# EAGLE design Schematic (EAGLE 7.3.0)
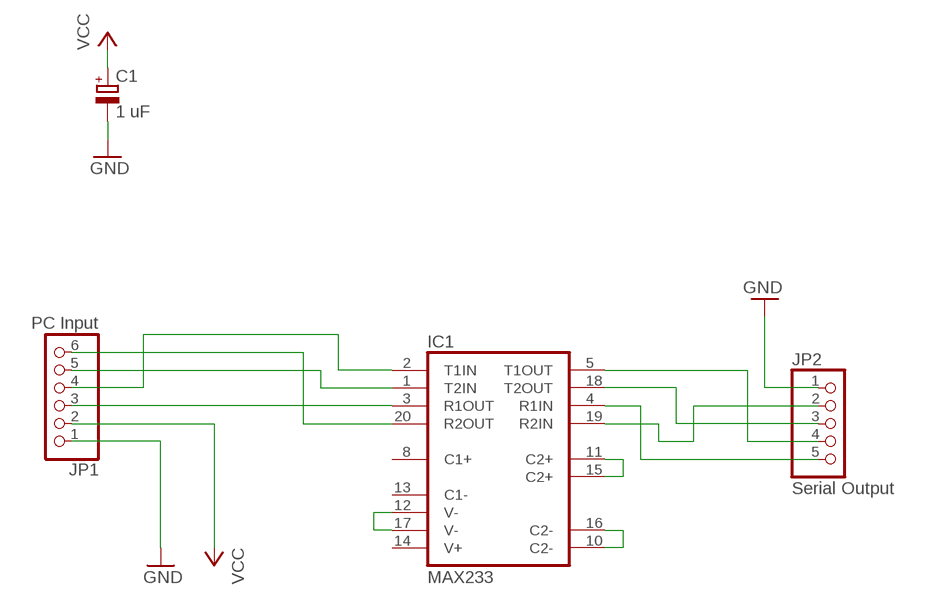
[diagram p0: schematic, sheet 1]

## Parts
C1  1 uF  CPOL-EUE2.5-6  [E2,5-6]
IC1  MAX233  [DIL20]
JP1  PC Input  PINHD-1X6  [1X06]
JP2  Serial Output  PINHD-1X5  [1X05]

## Nets
GND: C1.- JP1.1 JP2.1
N$1: IC1.12(V-) IC1.17(V-)
N$2: IC1.11(C2+) IC1.15(C2+)
N$3: IC1.10(C2-) IC1.16(C2-)
N$4: IC1.20(R2OUT) JP1.6
N$5: IC1.1(T2IN) JP1.5
N$6: IC1.2(T1IN) JP1.4
N$7: IC1.3(R1OUT) JP1.3
N$8: IC1.18(T2OUT) JP2.3
N$9: IC1.19(R2IN) JP2.2
N$10: IC1.5(T1OUT) JP2.4
N$11: IC1.4(R1IN) JP2.5
VCC: C1.+ JP1.2
Unconnected: IC1.8(C1+) IC1.13(C1-) IC1.14(V+)

## Power pins joined to a net without a drawn wire
GND: IC1.6(GND) IC1.9(GND)
VCC: IC1.7(VCC)

## Library data of the parts
C1 = resistor:CPOL-EU: POLARIZED CAPACITOR, European symbol
IC1 = maxim:MAX233: RS232 TRANSCEIVER; MPN: MAX233ACPP+G36; OC_FARNELL: 1593332; OC_NEWARK: 89K3459
JP1 = pinhead:PINHD-1X6: PIN HEADER
JP2 = pinhead:PINHD-1X5: PIN HEADER

## Board
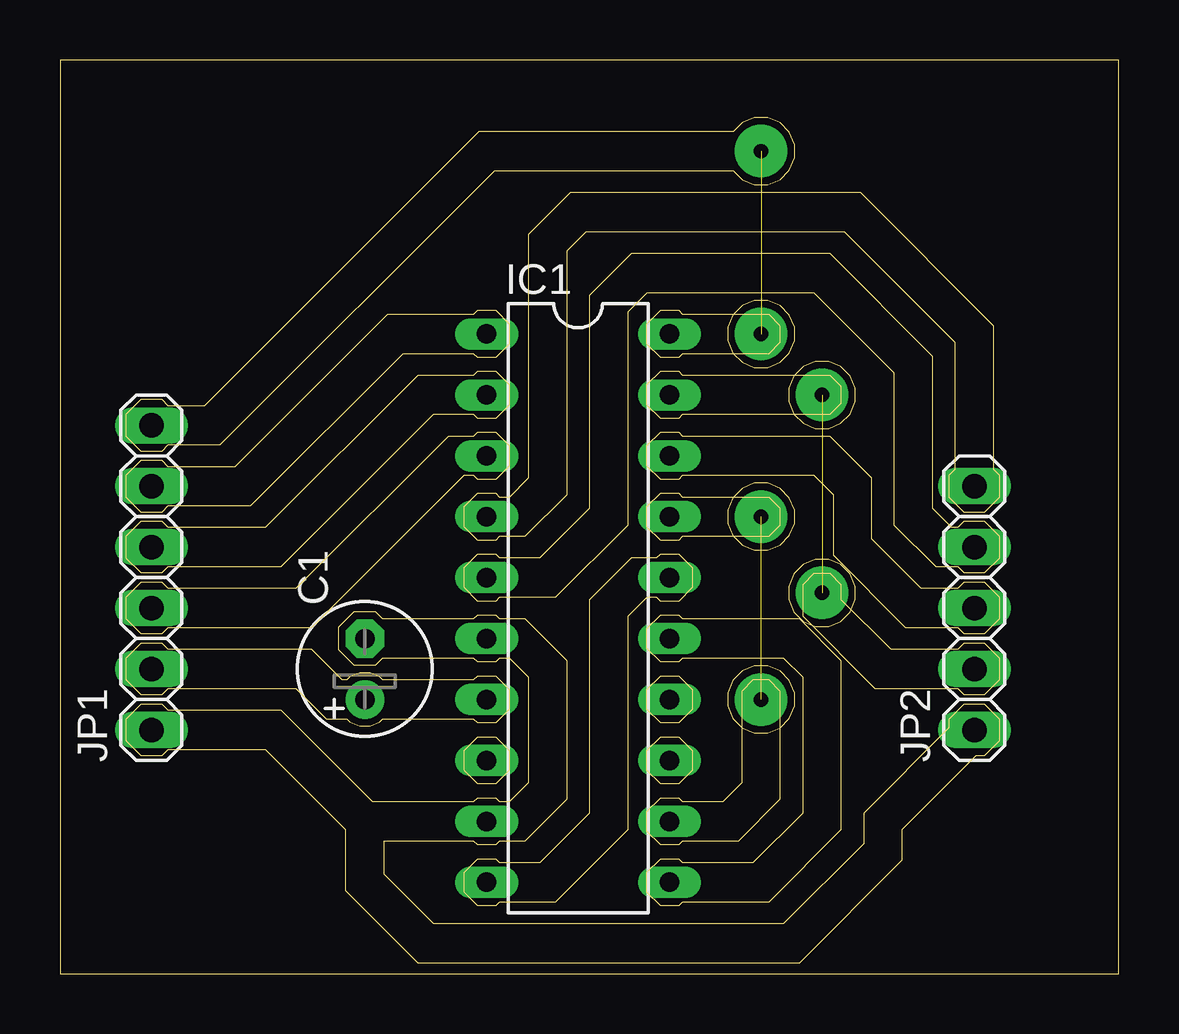
[diagram p1: board, top side]
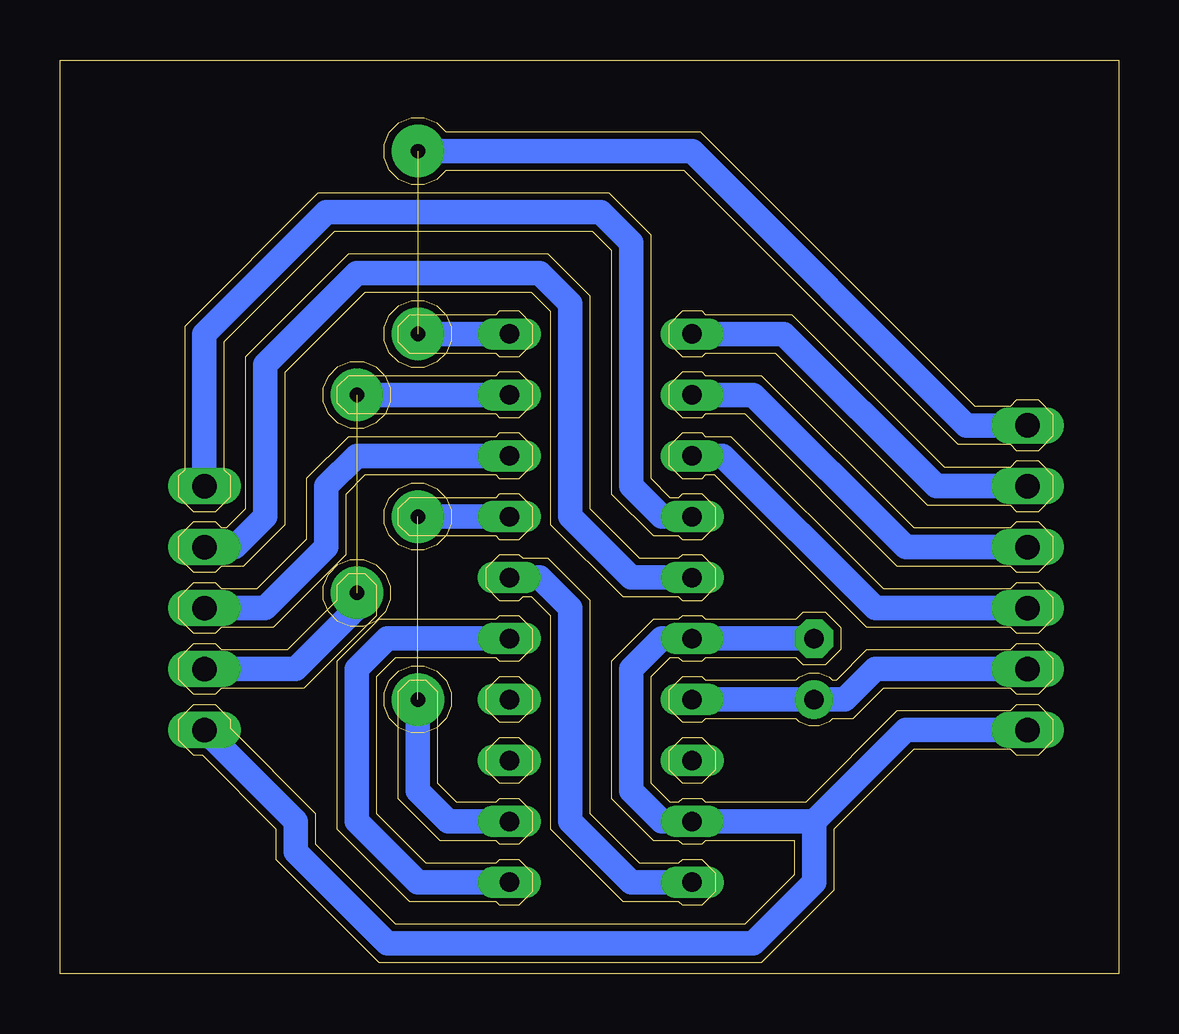
[diagram p2: board, bottom side, seen from below]

Size 44.12 x 38.09 mm. Coordinates in mm from the lower left corner, seen from the top.
Outline: 0,0 44.12,0 44.12,38.09 0,38.09 0,0
Copper layers (1*16): Top 0.035mm / dielectric 1.5mm / Bottom 0.035mm
Design rules "default *": minimum track width 40mil, minimum drill 24mil, track to track 20mil, track to pad 20mil, pad to pad 8mil, via to via 8mil, smd to smd 8mil, copper to edge 40mil, drill to drill 8mil, minimum pad ring 10mil, minimum via ring 8mil, stop-mask expansion 4mil, vias tented up to drill 0mil, thermal gap 10mil
Milling: 485 lines

### Footprints (pad centres in the part's own frame; a part is rotated, then mirrored left to right if it is on the bottom)
E2,5-6 = drill 0.813 pad 1.6: + -1.27,0 | drill 0.813 pad 1.6 octagon: - 1.27,0
DIL20 = drill 0.813 long: 1 -11.43,-3.81; 2 -8.89,-3.81; 3 -6.35,-3.81; 4 -3.81,-3.81; 5 -1.27,-3.81; 6 1.27,-3.81; 7 3.81,-3.81; 8 6.35,-3.81; 9 8.89,-3.81; 10 11.43,-3.81; 11 11.43,3.81; 12 8.89,3.81; 13 6.35,3.81; 14 3.81,3.81; 15 1.27,3.81; 16 -1.27,3.81; 17 -3.81,3.81; 18 -6.35,3.81; 19 -8.89,3.81; 20 -11.43,3.81
1X06 = drill 1.016 long: 1 -6.35,0; 2 -3.81,0; 3 -1.27,0; 4 1.27,0; 5 3.81,0; 6 6.35,0
1X05 = drill 1.016 long: 1 -5.08,0; 2 -2.54,0; 3 0,0; 4 2.54,0; 5 5.08,0

### Placement (x,y rotation side)
C1  12.7,12.7 90 top
IC1  21.59,15.24 270 top
JP1  3.81,16.51 90 top
JP2  38.1,15.24 90 top

### Tracks (layer width: path | path; a pad name or v marks a point on that pad's centre or on a via)
GND
  Bottom 1.016: C1.- IC1.6 19.05,13.97 20.32,12.7 20.32,7.62 19.05,6.35 IC1.9 12.7,6.35 | JP1.1 8.89,10.16 12.7,6.35 | JP2.1 34.29,6.35 34.29,5.08 30.48,1.27 15.24,1.27 12.7,3.81 12.7,6.35
N$1  (1 unrouted)
  Bottom 1.016: IC1.12 27.94,6.35 29.21,7.62 29.21,11.43 | IC1.17 29.21,19.05
N$2
  Bottom 1.016: IC1.11 29.21,3.81 31.75,6.35 31.75,12.7 30.48,13.97 IC1.15
N$3
  Bottom 1.016: IC1.10 20.32,3.81 22.86,6.35 22.86,15.24 24.13,16.51 IC1.16
N$4  (via drill 0.6 pad 2.18)  (1 unrouted)
  Bottom 1.016: IC1.20 29.21,26.67 | JP1.6 6.35,22.86 17.78,34.29 v29.21,34.29
N$5
  Bottom 1.016: JP1.5 7.62,20.32 13.97,26.67 IC1.1
N$6
  Bottom 1.016: IC1.2 15.24,24.13 8.89,17.78 JP1.4
N$7
  Bottom 1.016: JP1.3 10.16,15.24 16.51,21.59 IC1.3
N$8
  Bottom 1.016: JP2.3 35.56,15.24 33.02,17.78 33.02,20.32 31.75,21.59 IC1.18
N$9  (1 unrouted)
  Bottom 1.016: JP2.2 34.29,12.7 31.75,15.24 31.75,15.88 | IC1.19 31.75,24.13
N$10
  Bottom 1.016: IC1.5 20.32,16.51 22.86,19.05 22.86,27.94 24.13,29.21 31.75,29.21 35.56,25.4 35.56,19.05 36.83,17.78 JP2.4
N$11
  Bottom 1.016: JP2.5 38.1,26.67 33.02,31.75 21.59,31.75 20.32,30.48 20.32,20.32 19.05,19.05 IC1.4
N$12  (via drill 0.6 pad 2.18)
  other vias: 29.21,26.67
N$13  (via drill 0.6 pad 2.18)
  other vias: 29.21,11.43
N$14  (via drill 0.6 pad 2.18)
  other vias: 29.21,19.05
N$15  (via drill 0.6 pad 2.18)
  other vias: 31.75,24.13
N$16  (via drill 0.6 pad 2.18)
  other vias: 31.75,15.88
VCC
  Bottom 1.016: JP1.2 10.16,12.7 11.43,11.43 C1.+ IC1.7